# EAGLE design touch_controller (EAGLE 8.2.2)
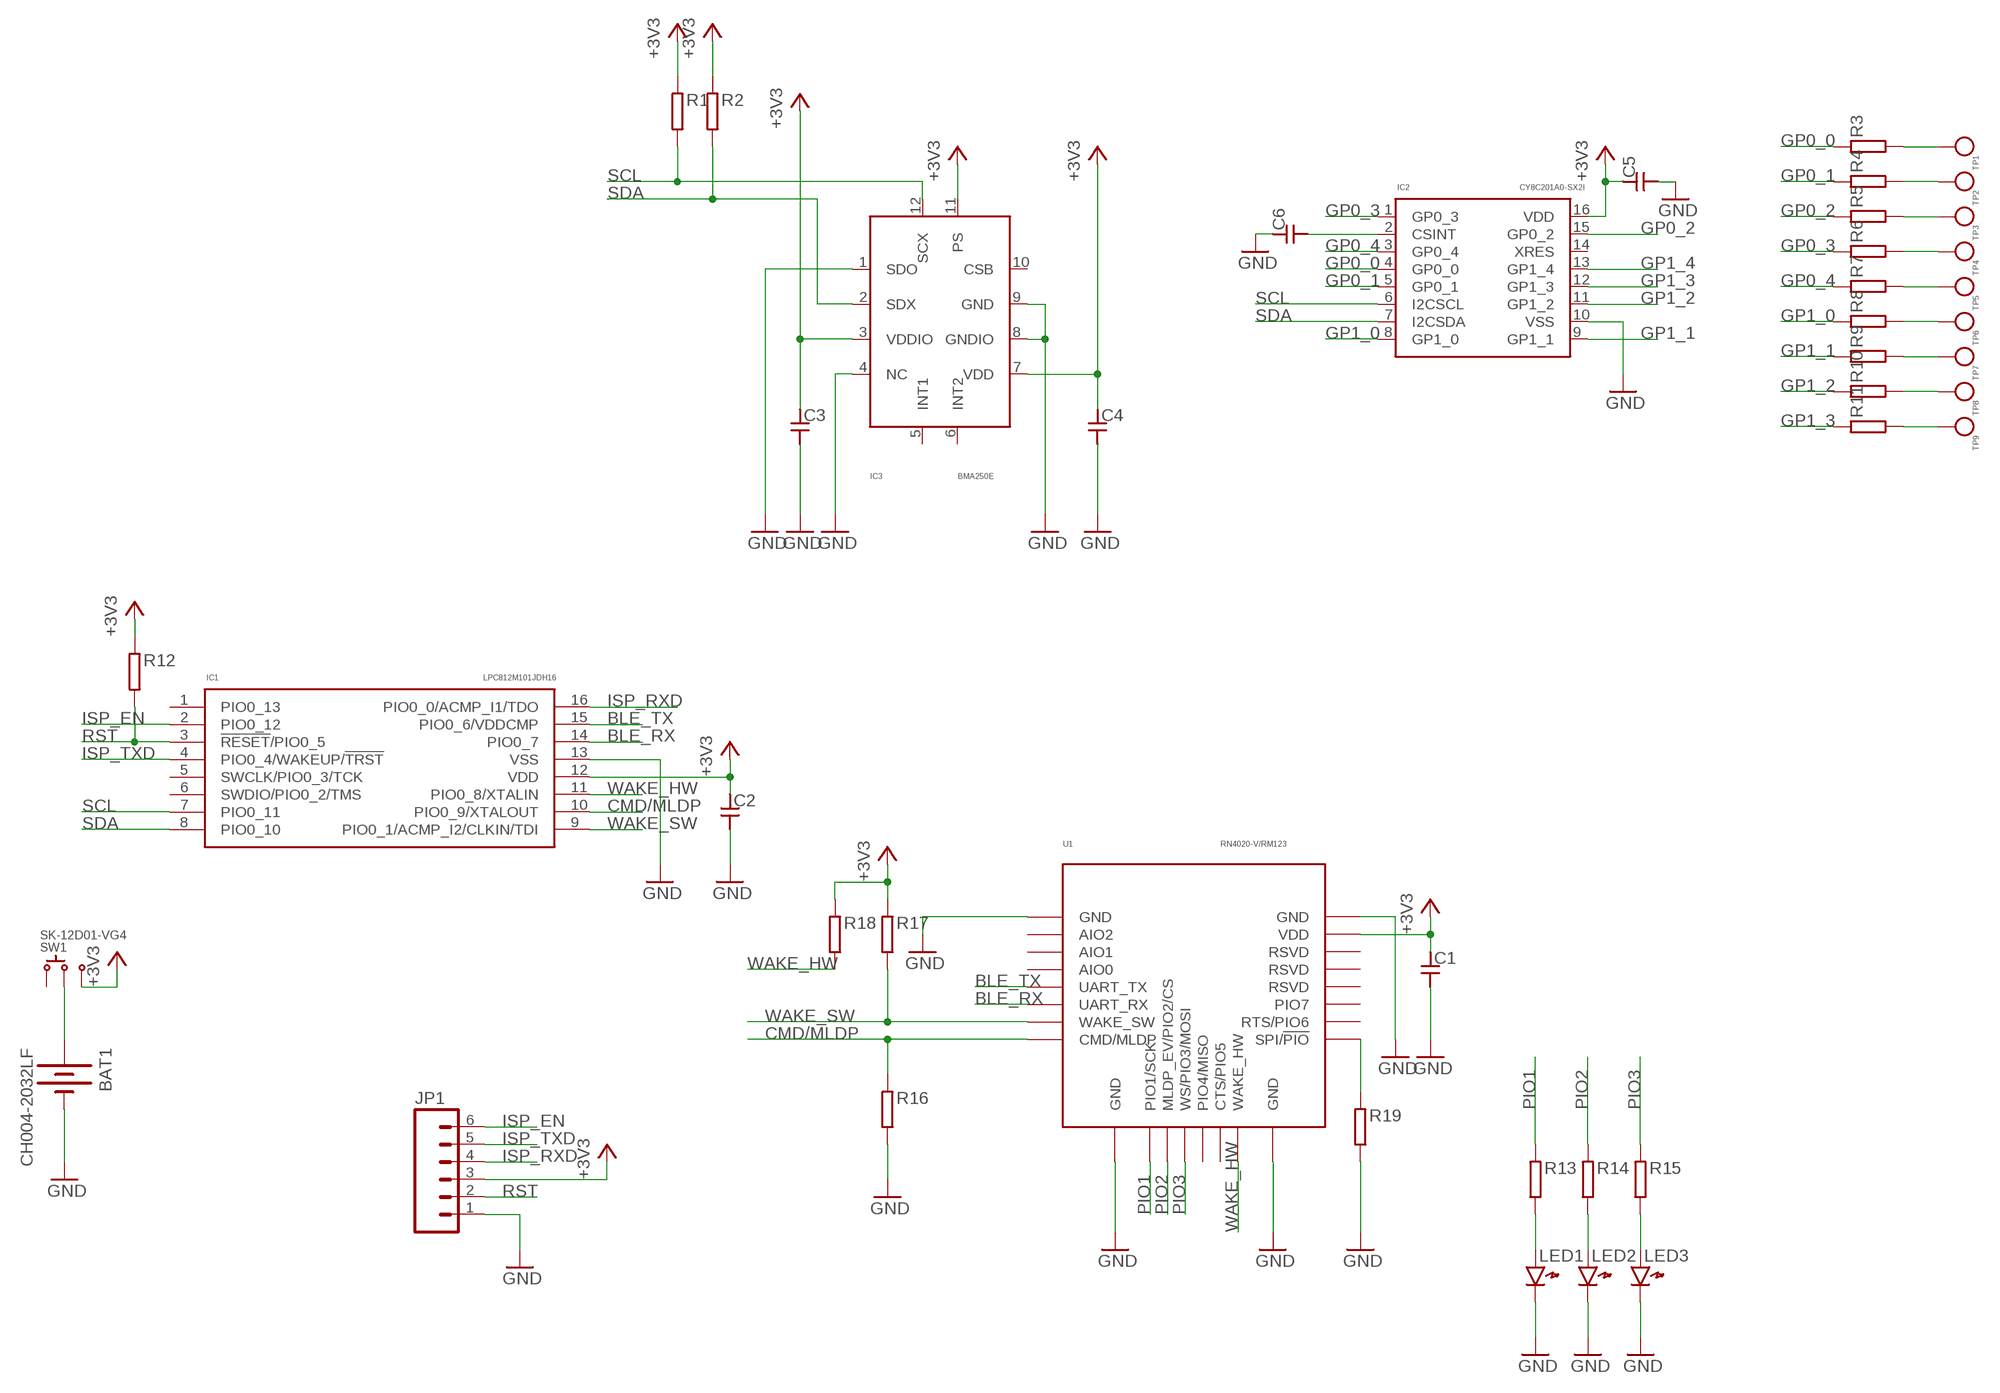
[diagram p0: schematic, sheet 1]

## Parts
BAT1  CH004-2032LF  [CH004-2032LF]
C1  CAPACITOR1608_REDUCED  [SMD1608_REDUCED]
C2  CAPACITOR1608_REDUCED  [SMD1608_REDUCED]
C3  CAPACITOR1608_REDUCED  [SMD1608_REDUCED]
C4  CAPACITOR1608_REDUCED  [SMD1608_REDUCED]
C5  CAPACITOR1608_REDUCED  [SMD1608_REDUCED]
C6  CAPACITOR1608_REDUCED  [SMD1608_REDUCED]
IC1  LPC812M101JDH16  [TSSOP16]
IC2  CY8C201A0-SX2I  [SOIC-16]
IC3  BMA250E  [LGA-12]
JP1  M06NOSILK  [1X06-NOSILK]
LED1  LED1608_REDUCED  [LED1608_REDUCED]
LED2  LED1608_REDUCED  [LED1608_REDUCED]
LED3  LED1608_REDUCED  [LED1608_REDUCED]
R1  RESISTOR1608_REDUCED  [SMD1608_REDUCED]
R2  RESISTOR1608_REDUCED  [SMD1608_REDUCED]
R3  RESISTOR1608_REDUCED  [SMD1608_REDUCED]
R4  RESISTOR1608_REDUCED  [SMD1608_REDUCED]
R5  RESISTOR1608_REDUCED  [SMD1608_REDUCED]
R6  RESISTOR1608_REDUCED  [SMD1608_REDUCED]
R7  RESISTOR1608_REDUCED  [SMD1608_REDUCED]
R8  RESISTOR1608_REDUCED  [SMD1608_REDUCED]
R9  RESISTOR1608_REDUCED  [SMD1608_REDUCED]
R10  RESISTOR1608_REDUCED  [SMD1608_REDUCED]
R11  RESISTOR1608_REDUCED  [SMD1608_REDUCED]
R12  RESISTOR1608_REDUCED  [SMD1608_REDUCED]
R13  RESISTOR1608_REDUCED  [SMD1608_REDUCED]
R14  RESISTOR1608_REDUCED  [SMD1608_REDUCED]
R15  RESISTOR1608_REDUCED  [SMD1608_REDUCED]
R16  RESISTOR1608_REDUCED  [SMD1608_REDUCED]
R17  RESISTOR1608_REDUCED  [SMD1608_REDUCED]
R18  RESISTOR1608_REDUCED  [SMD1608_REDUCED]
R19  RESISTOR1608_REDUCED  [SMD1608_REDUCED]
SW1  SK-12D01-VG4  [SK-12D01-VG4]
TP1  HT-0720-10  [HT-0720-10]
TP2  HT-0720-10  [HT-0720-10]
TP3  HT-0720-10  [HT-0720-10]
TP4  HT-0720-10  [HT-0720-10]
TP5  HT-0720-10  [HT-0720-10]
TP6  HT-0720-10  [HT-0720-10]
TP7  HT-0720-10  [HT-0720-10]
TP8  HT-0720-10  [HT-0720-10]
TP9  HT-0720-10  [HT-0720-10]
U1  RN4020-V/RM123  [RN4020]

## Nets
+3V3: C1.1 C2.1 C3.1 C4.1 C5.1 IC1.12(VDD) IC2.16(VDD) IC3.3(VDDIO) IC3.7(VDD) IC3.11(PS) JP1.3 R1.1 R2.1 R12.1 R17.1 R18.1 SW1.3 U1.23(VDD)
BLE_RX: IC1.14(PIO0_7) U1.6(UART_RX)
BLE_TX: IC1.15(PIO0_6/VDDCMP) U1.5(UART_TX)
CMD/MLDP: IC1.10(PIO0_9/XTALOUT) R16.1 U1.8(CMD/MLDP)
GND: BAT1.- C1.2 C2.2 C3.2 C4.2 C5.2 C6.1 IC1.13(VSS) IC2.10(VSS) IC3.1(SDO) IC3.4(NC) IC3.8(GNDIO) IC3.9(GND) JP1.1 LED1.K LED2.K LED3.K R16.2 R19.2 U1.1(GND) U1.9(GND) U1.16(GND) U1.24(GND)
GP0_0: IC2.4(GP0_0) R3.1
GP0_1: IC2.5(GP0_1) R4.1
GP0_2: IC2.15(GP0_2) R5.1
GP0_3: IC2.1(GP0_3) R6.1
GP0_4: IC2.3(GP0_4) R7.1
GP1_0: IC2.8(GP1_0) R8.1
GP1_1: IC2.9(GP1_1) R9.1
GP1_2: IC2.11(GP1_2) R10.1
GP1_3: IC2.12(GP1_3) R11.1
GP1_4: IC2.13(GP1_4)
ISP_EN: IC1.2(PIO0_12) JP1.6
ISP_RXD: IC1.16(PIO0_0/ACMP_I1/TDO) JP1.4
ISP_TXD: IC1.4(PIO0_4/WAKEUP/!TRST) JP1.5
N$1: BAT1.+ SW1.2
N$2: C6.2 IC2.2(CSINT)
N$3: R3.2 TP1.P$1
N$4: R4.2 TP2.P$1
N$5: R5.2 TP3.P$1
N$6: R6.2 TP4.P$1
N$7: R7.2 TP5.P$1
N$8: R8.2 TP6.P$1
N$9: R9.2 TP7.P$1
N$10: R10.2 TP8.P$1
N$11: R11.2 TP9.P$1
N$12: R19.1 U1.17(SPI/!PIO)
N$14: LED1.A R13.2
N$15: LED2.A R14.2
N$16: LED3.A R15.2
PIO1: R13.1 U1.10(PIO1/SCK)
PIO2: R14.1 U1.11(MLDP_EV/PIO2/CS)
PIO3: R15.1 U1.12(WS/PIO3/MOSI)
RST: IC1.3(!RESET!/PIO0_5) JP1.2 R12.2
SCL: IC1.7(PIO0_11) IC2.6(I2CSCL) IC3.12(SCX) R1.2
SDA: IC1.8(PIO0_10) IC2.7(I2CSDA) IC3.2(SDX) R2.2
WAKE_HW: IC1.11(PIO0_8/XTALIN) R18.2 U1.15(WAKE_HW)
WAKE_SW: IC1.9(PIO0_1/ACMP_I2/CLKIN/TDI) R17.2 U1.7(WAKE_SW)
Unconnected: IC1.1(PIO0_13) IC1.5(SWCLK/PIO0_3/TCK) IC1.6(SWDIO/PIO0_2/TMS) IC2.14(XRES) IC3.5(INT1) IC3.6(INT2) IC3.10(CSB) SW1.1 U1.2(AIO2) U1.3(AIO1) U1.4(AIO0) U1.13(PIO4/MISO) U1.14(CTS/PIO5) U1.18(RTS/PIO6) U1.19(PIO7) U1.20(RSVD) U1.21(RSVD) U1.22(RSVD)

## Library data of the parts
BAT1 = battery:CH004-2032LF: CR2032 x 1 akizuki : P-11255
C1-C6 = generic:CAPACITOR: Generic Capacitor
IC1 = micro_controller:LPC812M101JDH16: NXP LPC812 TSSOP-16
IC2 = touch_sensor:CY8C201A0: Cypress touch sensor
IC3 = acceleration_sensor:BMA250E: Bosch Triaxial Acceleraration Sensor 2g,4g,8g,16g 3-wire,4-wire,I2C,SPI 1.2V ~ 3.6V
JP1 = header:M06
LED1-LED3 = generic:LED: Generic LEDs
R1-R19 = generic:RESISTOR: Generic Registor
SW1 = switch:SK-12D01-VG4: Slide switch ON-(ON) akizuki: P-08789
TP1-TP9 = test_pin:HT-0720-10
U1 = com_module:RN4020: Bluetooth Low Energy Module Microchip

## Board
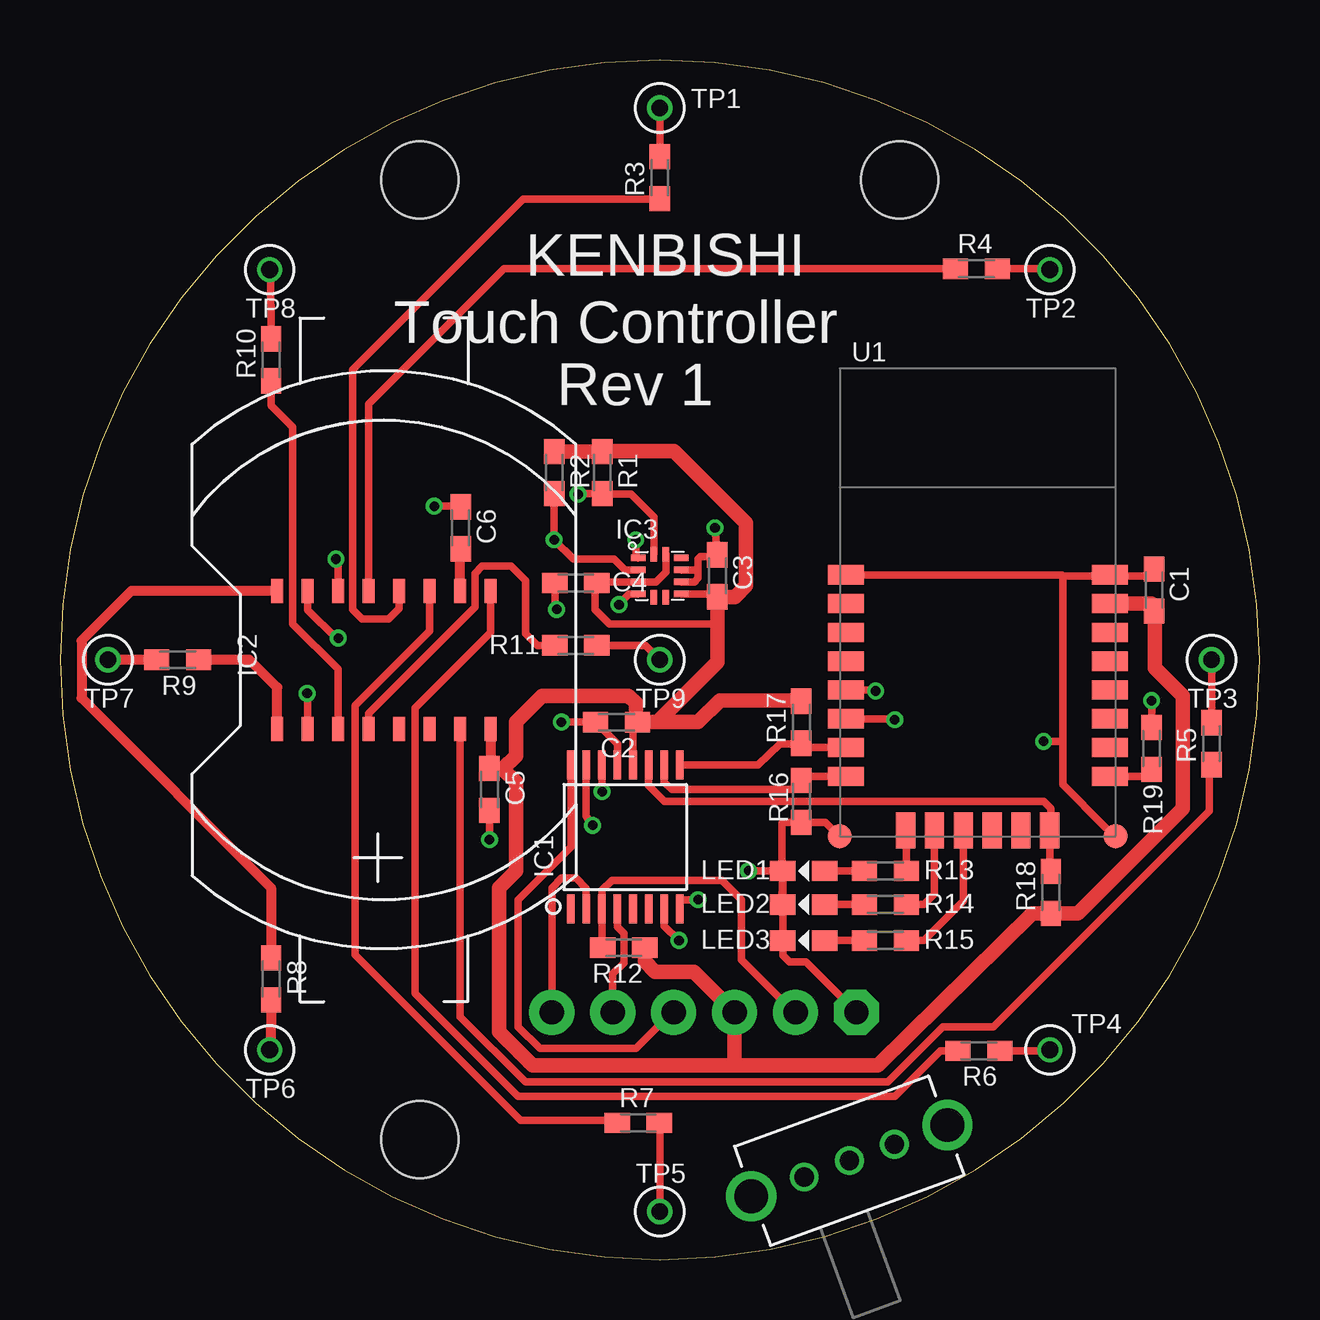
[diagram p1: board, top side]
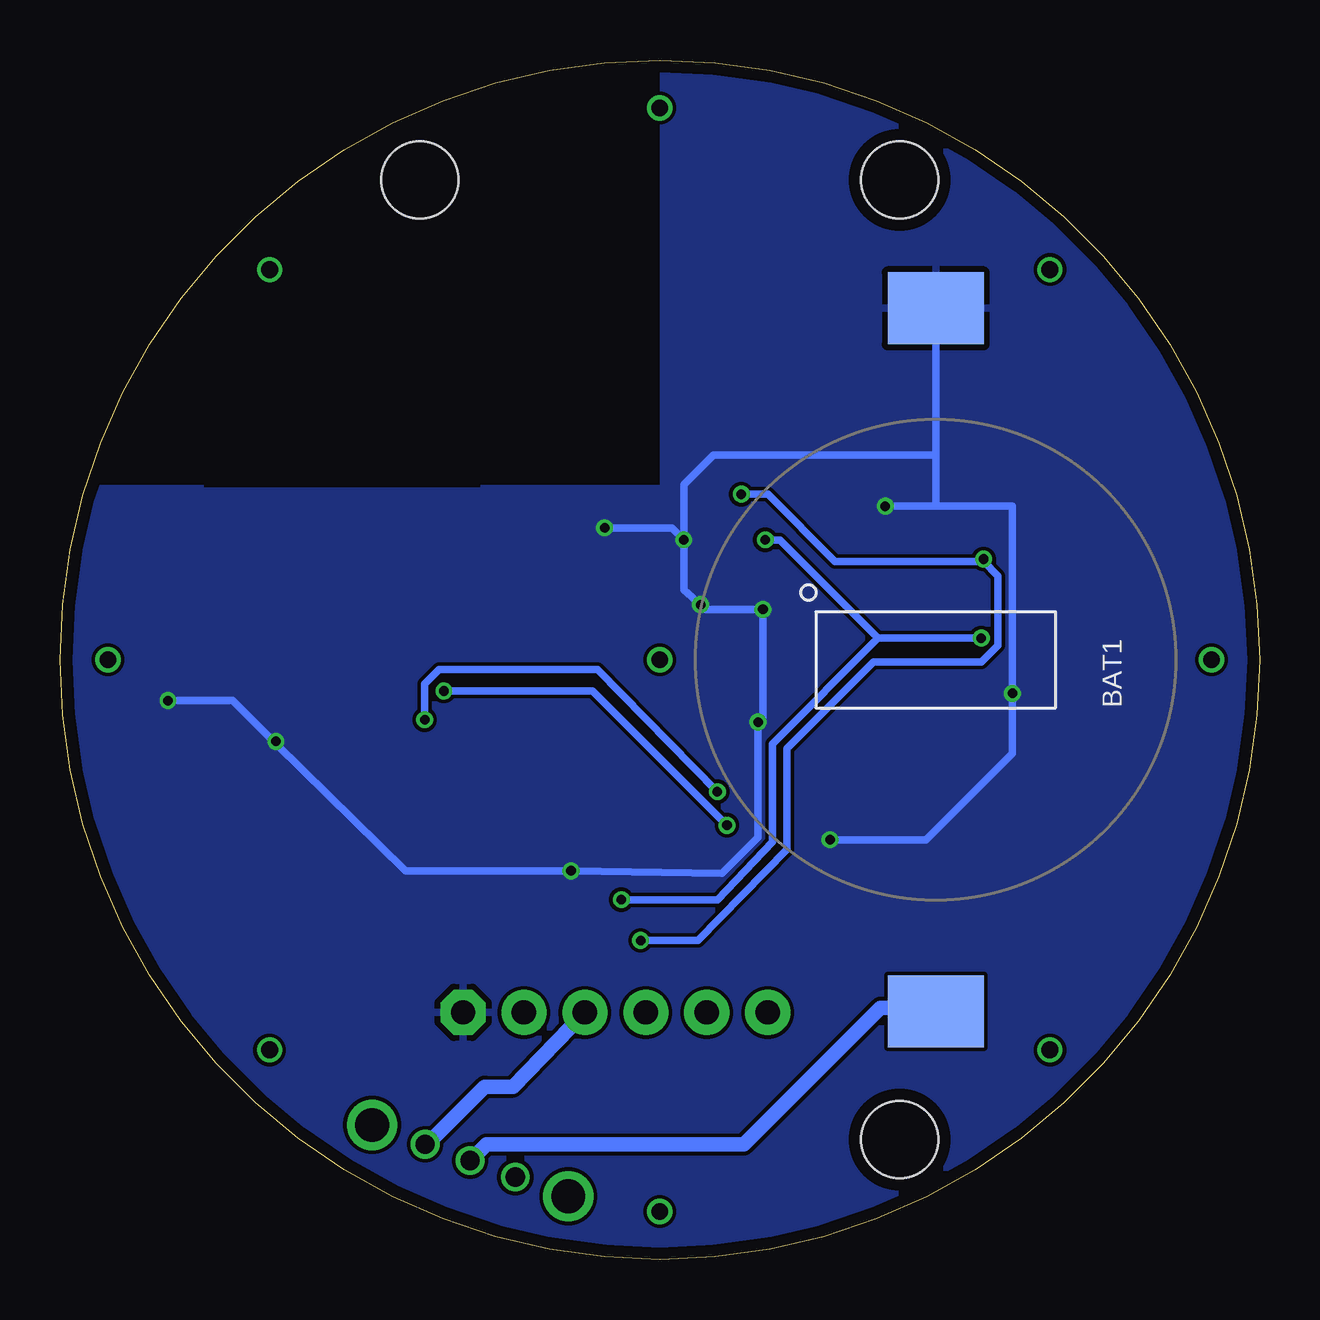
[diagram p2: board, bottom side, seen from below]

Size 50 x 50 mm. Coordinates in mm from the lower left corner, seen from the top.
Outline: 0,25 arc90 25,0 arc90 50,25 arc90 25,50 arc90 0,25
Copper layers (1*16): Top 0.035mm / dielectric 1.6mm / Bottom 0.035mm
Design rules "Elecrow_2-layer_PCB_eagle_rule": minimum track width 6mil, minimum drill 12mil, track to track 6mil, track to pad 6mil, pad to pad 6mil, via to via 8mil, smd to smd 0mil, copper to edge 20mil, drill to drill 10mil, minimum pad ring 6mil, minimum via ring 6mil, stop-mask expansion 0mil, vias tented up to drill 100mil, thermal gap 10mil
Holes 3.2 mm at 35,45 15,5 15,45
bRestrict: area 25,32.3 to 57.9,49.9

### Footprints (pad centres in the part's own frame; a part is rotated, then mirrored left to right if it is on the bottom)
CH004-2032LF = smd 3 x 4: + -14.65,0; - 14.65,0
SMD1608_REDUCED = smd 1.05 x 0.85: 1 -0.875,0; 2 0.875,0
TSSOP16 = smd 0.32 x 1.2: 1 -2.275,-3; 2 -1.625,-3; 3 -0.975,-3; 4 -0.325,-3; 5 0.325,-3; 6 0.975,-3; 7 1.625,-3; 8 2.275,-3; 9 2.275,3; 10 1.625,3; 11 0.975,3; 12 0.325,3; 13 -0.325,3; 14 -0.975,3; 15 -1.625,3; 16 -2.275,3
SOIC-16 = smd 0.5 x 1: 1 -4.445,-2.875; 2 -3.175,-2.875; 3 -1.905,-2.875; 4 -0.635,-2.875; 5 0.635,-2.875; 6 1.905,-2.875; 7 3.175,-2.875; 8 4.445,-2.875; 9 4.445,2.875; 10 3.175,2.875; 11 1.905,2.875; 12 0.635,2.875; 13 -0.635,2.875; 14 -1.905,2.875; 15 -3.175,2.875; 16 -4.445,2.875
LGA-12 = smd 0.6 x 0.28: 1 -0.9,0.75; 2 -0.9,0.25; 3 -0.9,-0.25; 4 -0.9,-0.75; 7 0.9,-0.75; 8 0.9,-0.25; 9 0.9,0.25; 10 0.9,0.75 | smd 0.28 x 0.6: 5 -0.25,-0.9; 6 0.25,-0.9; 11 0.25,0.9; 12 -0.25,0.9
1X06-NOSILK = drill 1.016 pad 1.88 octagon: 1 0,0 | drill 1.016 pad 1.88: 2 2.54,0; 3 5.08,0; 4 7.62,0; 5 10.16,0; 6 12.7,0
LED1608_REDUCED = smd 1.05 x 0.85: A -0.875,0; K 0.875,0
SK-12D01-VG4 = drill 0.8: 1 -2,0; 2 0,0; 3 2,0 | drill 1.4: 4 4.35,0; 5 -4.35,0
HT-0720-10 = drill 0.7: P$1 0,0
RN4020 = smd 1.5 x 0.8: 1 0.25,10.9; 2 0.25,9.7; 3 0.25,8.5; 4 0.25,7.3; 5 0.25,6.1; 6 0.25,4.9; 7 0.25,3.7; 8 0.25,2.5; 17 11.25,2.5; 18 11.25,3.7; 19 11.25,4.9; 20 11.25,6.1; 21 11.25,7.3; 22 11.25,8.5; 23 11.25,9.7; 24 11.25,10.9 | smd 1 x 1: 9 0,0; 16 11.5,0 | smd 0.8 x 1.5: 10 2.75,0.25; 11 3.95,0.25; 12 5.15,0.25; 13 6.35,0.25; 14 7.55,0.25; 15 8.75,0.25

### Placement (x,y rotation side)
BAT1  13.5,25 90 bottom
C1  45.6,27.91 90 top
C2  23.2,22.4 180 top
C3  27.4,28.5 90 top
C4  21.5,28.2 180 top
C5  17.9,19.6 270 top
C6  16.7,30.5 270 top
IC1  23.56,17.61 0 top
IC2  13.5,25 180 top
IC3  25,28.5 0 top
JP1  33.2,10.3 180 top
LED1  31,16.2 180 top
LED2  31,14.8 180 top
LED3  31,13.3 180 top
R1  22.6,32.8 270 top
R2  20.6,32.8 270 top
R3  25,45.1 90 top
R4  38.2,41.3 0 top
R5  48,21.5 90 top
R6  38.3,8.7 0 top
R7  24.1,5.7 0 top
R8  8.8,11.7 270 top
R9  4.9,25 180 top
R10  8.8,37.5 90 top
R11  21.5,25.6 0 top
R12  23.5,13 180 top
R13  34.4,16.2 180 top
R14  34.4,14.8 180 top
R15  34.4,13.3 180 top
R16  30.9,19.1 270 top
R17  30.9,22.4 270 top
R18  41.3,15.3 90 top
R19  45.5,21.3 90 top
SW1  32.9,4.12 20 top
TP1  25,48 0 top
TP2  41.26,41.26 0 top
TP3  48,25 0 top
TP4  41.26,8.74 0 top
TP5  25,2 0 top
TP6  8.74,8.74 0 top
TP7  2,25 0 top
TP8  8.74,41.26 0 top
TP9  25,25 0 top
U1  32.5,17.64 0 top

### Tracks (layer width: path | path; a pad name or v marks a point on that pad's centre or on a via)
+3V3
  Top 0.305: 43.77,27.34 U1.23 | IC1.12 23.89,22.21 23.98,22.31 C2.1 | 45.63,27 C1.1 | 22.6,28.13 22.82,28.25 IC3.3 24.85,28.25 25.25,28.65 IC3.11 | 22.6,28.13 C4.1 | IC3.7 27.18,27.75 C3.1 27.3,27.55 | 22.6,28.13 22.33,28.23 22.3,28 22.3,27.1 22.9,26.5 27.27,26.5 27.4,26.37 | 27.45,27.7 27.3,27.55 | 22.61,33.69 R1.1 | 27.4,27.45 27.3,27.55
  Top 0.406: IC2.16 17.95,20.52 C5.1
  Top 0.61: 17.88,20.5 C5.1 18.48,20.48 | 28.12,8.1 19.7,8.1 18.3,9.5 18.3,15.5 19,16.2 19,19.9 18.48,20.43 18.48,20.48 | 28.12,8.1 34.1,8.1 40.52,14.43 R18.1 42.42,14.43 46.8,18.8 46.8,23.5 45.63,24.66 45.63,27 | 28.12,8.1 28.12,9.4 JP1.3 26.42,12 24.8,12 24.38,12.43 R12.1 | 43.8,27.3 43.77,27.34 | C1.1 45.49,27.34 U1.23 | 18.48,20.48 19,21 19,22.4 20.1,23.5 23.7,23.5 24,23.2 24,22.32 23.98,22.31 | 24.9,22.4 C2.1 | 24.9,22.4 27.4,24.9 27.4,26.37 C3.1 28.12,27.62 28.6,28.1 28.6,30.7 25.6,33.7 22.62,33.7 22.61,33.69 | R1.1 R2.1 | 24.9,22.4 26.6,22.4 27.5,23.3 30.88,23.3 R17.1
  Bottom 0.61: SW1.3 34.69,4.81 32.3,7.2 31.12,7.2 JP1.3
BLE_RX  (via drill 0.4)
  Top 0.305: U1.6 34.64,22.54 34.8,22.6 v34.8,22.5 | IC1.14 22.59,19.52 v22.6,19.5
  Bottom 0.305: v34.8,22.5 34.8,24 34.2,24.6 27.6,24.6 v22.6,19.5
BLE_TX  (via drill 0.4)
  Top 0.305: U1.5 33.86,23.74 v34,23.7 | IC1.15 21.93,18.5 v22.2,18.1
  Bottom 0.305: v22.2,18.1 27.8,23.7 v34,23.7
CMD/MLDP
  Top 0.305: U1.8 31.07,20.14 R16.1 30.88,19.6 25.5,19.6 25.18,19.91 IC1.10
GND  (via drill 0.4)
  Top 0.305: IC2.10 10.32,23.57 v10.3,23.6 | C6.1 16.43,31.38 16.6,31.4 v15.6,31.4 | C1.2 45.59,28.48 44.7,28.5 43.79,28.5 U1.24 43.71,28.5 41.8,28.5 | LED1.K LED2.K LED3.K 30.12,12.68 30.4,12.4 31.1,12.4 JP1.1 | IC1.13 23.23,21.49 C2.2 v20.9,22.4 | IC3.4 23.73,27.75 23.5,27.52 v23.3,27.3 23.3,27.1 | IC3.8 26.45,28.25 26.6,28.4 26.6,28.67 | 26.6,28.67 26.6,29.2 26.7,29.3 27.23,29.3 C3.2 v27.3,30.5 | IC3.9 26.52,28.75 26.6,28.67 | IC3.1 24,29.35 v24,30 | R16.2 30.88,17.9 30.9,17.9 R16.2 | 30.1,15.3 30.1,14.43 LED1.K | 32.36,17.64 U1.9 31.91,18.23 R16.2 | U1.16 43.56,18.04 41.8,19.8 41.8,21.54 | 41.8,21.54 41.8,28.5 | U1.1 41.76,28.54 41.8,28.5 | v41,21.6 41.73,21.6 41.8,21.54 | R19.2 v45.5,23.3 | 17.88,18.7 C5.2 v17.9,17.5 | C4.2 20.62,27.18 v20.7,27.1 | LED1.K 30.1,16.23 30.1,18.2 30.12,18.23 R16.2 | v28.7,16.2 LED1.K
  Bottom 0.305: 13.5,33.54 13.5,31.4 | 13.5,33.54 BAT1.- | 13.5,31.4 10.3,31.4 v10.3,23.6 10.3,21.1 13.9,17.5 v17.9,17.5 | v15.6,31.4 13.5,31.4 | v24,30 24,32.3 22.76,33.54 13.5,33.54 | v24,30 24,27.9 v23.3,27.3 23.1,27.1 v20.7,27.1 20.7,22.6 v20.9,22.4 20.9,17.6 22.4,16.1 v28.7,16.2 35.6,16.2 41,21.5 | v27.3,30.5 24.5,30.5 v24,30 | 41,21.5 v41,21.6 | v45.5,23.3 42.8,23.3 41,21.5
  pour Bottom: 0,0 50,0 50,50 0,50
GP0_0
  Top 0.305: IC2.4 14.13,27.14 13.7,26.7 12.6,26.7 12.2,27.1 12.2,37.1 19.3,44.2 24.98,44.2 R3.1
GP0_1
  Top 0.305: IC2.5 12.87,35.66 18.5,41.3 R4.1
GP0_2
  Top 0.305: 16.7,22.1 IC2.15 16.68,10.12 19.4,7.4 34.5,7.4 36.8,9.7 38.9,9.7 47.9,18.7 47.9,20.23 R5.1
  Top 0.406: 47.8,20.43 R5.1
GP0_3
  Top 0.305: IC2.1 17.95,26.14 14.8,23 14.8,11.1 19.1,6.8 34.8,6.8 36.7,8.7 R6.1
GP0_4
  Top 0.305: IC2.3 15.4,26.2 12.3,23.1 12.3,12.7 19.2,5.8 23.12,5.8 R7.1
GP1_0
  Top 0.406: IC2.8 2.98,27.88 0.9,25.8 0.9,23.4 8.8,15.5 R8.1
GP1_1
  Top 0.406: R9.1 7.9,25 9.05,23.84 IC2.9
GP1_2
  Top 0.305: IC2.11 11.6,24.61 9.7,26.5 9.7,34.7 8.8,35.6 8.8,36.58
  Top 0.406: 8.8,36.58 R10.1
GP1_3
  Top 0.305: IC2.12 12.87,22.77 17.3,27.2 17.3,28.6 17.6,28.9 18.8,28.9 19.4,28.3 19.4,26.1 19.9,25.6 R11.1
ISP_EN
  Top 0.305: IC1.2 21.93,15.46 21.5,15.9 20.9,15.9 20.5,15.5 JP1.6
ISP_RXD
  Top 0.305: JP1.4 25.5,10.3 24,8.8 20,8.8 19.1,9.7 19.1,15 21.3,17.2 21.3,20.59 IC1.16
ISP_TXD
  Top 0.305: IC1.4 23.23,13.87 23.5,13.6 23.5,12.36 23.04,11.9 JP1.5
N$1
  Bottom 0.61: SW1.2 32.23,4.8 21.5,4.8 15.8,10.5 14.1,10.5 14,10.4 13.55,10.4 BAT1.+
N$2
  Top 0.406: IC2.2 16.68,29.3 C6.2
N$3
  Top 0.305: R3.2 TP1.P$1
N$4
  Top 0.305: R4.2 41.23,41.3 TP2.P$1
N$5
  Top 0.305: R5.2 TP3.P$1
N$6
  Top 0.305: R6.2 41.23,8.7 TP4.P$1
N$7
  Top 0.305: TP5.P$1 25,5.67 R7.2
N$8
  Top 0.406: R8.2 8.78,8.7 TP6.P$1
N$9
  Top 0.406: R9.2 TP7.P$1
N$10
  Top 0.305: R10.2 8.78,41.3 TP8.P$1
N$11
  Top 0.305: R11.2 24.4,25.6 TP9.P$1
N$12
  Top 0.305: U1.17 45.44,20.14 R19.1
N$14
  Top 0.305: LED1.A R13.2
N$15
  Top 0.305: R14.2 LED2.A
N$16
  Top 0.305: LED3.A R15.2
PIO1
  Top 0.305: U1.10 35.27,17.86 R13.1
PIO2
  Top 0.305: U1.11 36.45,15.25 36,14.8 R14.1
PIO3
  Top 0.305: U1.12 37.65,14.95 36,13.3 R15.1
RST
  Top 0.305: R12.2 22.59,13.14 IC1.3 22.6,14.62 22.6,15.4 23,15.8 27.6,15.8 28.4,15 28.4,12.5 30.6,10.3 JP1.2
SCL  (via drill 0.4)
  Top 0.305: IC3.12 24.75,30.95 23.8,31.9 22.62,31.9 R1.2 21.93,31.93 v21.6,31.9 | v11.5,29.2 11.6,29.11 IC2.6 | IC1.7 25.18,13.91 v25.8,13.3
  Bottom 0.305: v11.5,29.2 11.5,29.1 | v25.8,13.3 23.4,13.3 19.7,17.1 19.7,21.3 16.1,24.9 11.6,24.9 10.9,25.6 10.9,28.5 11.5,29.1 | v21.6,31.9 20.5,31.9 17.7,29.1 11.5,29.1
SDA  (via drill 0.4)
  Top 0.305: IC3.2 23.55,28.75 23.1,29.2 21.4,29.2 v20.6,30 R2.2 | IC2.7 10.32,27.07 11.5,25.9 v11.6,25.9 | v26.6,15 25.82,15 IC1.8
  Bottom 0.305: 15.9,25.9 v11.6,25.9 | 15.9,25.9 20,30 v20.6,30 | v26.6,15 22.6,15 20.3,17.4 20.3,21.5 15.9,25.9
WAKE_HW
  Top 0.305: IC1.11 24.54,19.77 25.2,19.1 41,19.1 41.3,18.8 41.3,17.94 U1.15 41.25,16.23 R18.2
WAKE_SW
  Top 0.305: U1.7 31.09,21.34 R17.2 | 30.77,21.4 R17.2 | IC1.9 29.09,20.61 30,21.5 30.88,21.5 R17.2

### Text on the board
tPlace: KENBISHI | Touch Controller | Rev 1